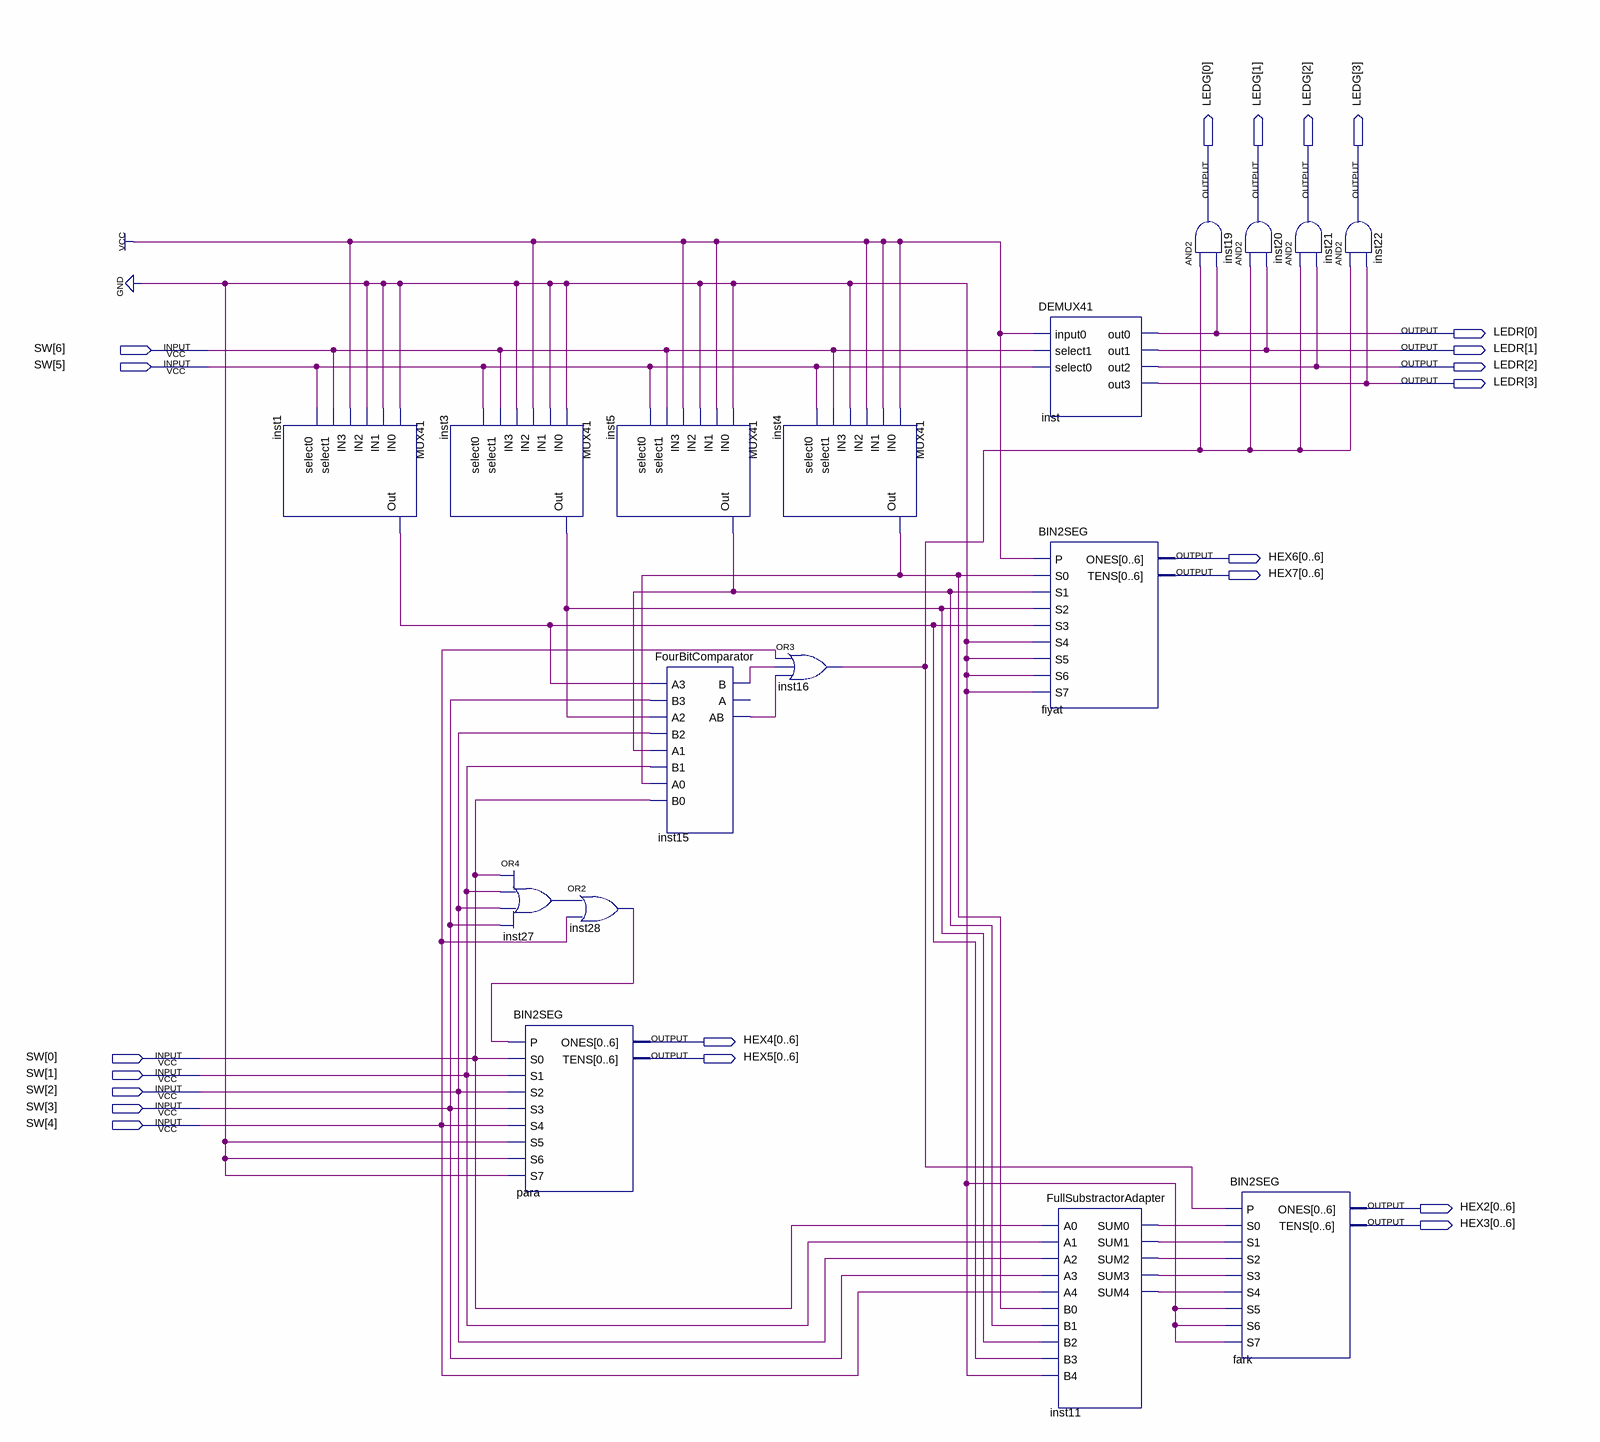
[diagram p0: schematic sheet]
// Quartus schematic Vending_Machine.bdf as structural Verilog: 17 symbols, 21 pins
module Vending_Machine (
  input  [6:0] SW,
  output [3:0] LEDG,
  output [3:0] LEDR,
  output [0:6] HEX6,
  output [0:6] HEX7,
  output [0:6] HEX4,
  output [0:6] HEX5,
  output [0:6] HEX2,
  output [0:6] HEX3
);

  wire inst1_out, inst3_out, inst4_out, inst5_out, inst11_sum0, inst11_sum1, inst11_sum2, inst11_sum3,
       inst11_sum4, inst15_ab, inst15_b, inst16_out, inst27_out, inst28_out;

  MUX41 inst1 (.IN0(1'b0), .IN1(1'b0), .IN2(1'b0), .IN3(1'b1), .select1(SW[6]), .select0(SW[5]), .Out(inst1_out));
  MUX41 inst3 (.IN0(1'b0), .IN1(1'b0), .IN2(1'b1), .IN3(1'b0), .select1(SW[6]), .select0(SW[5]), .Out(inst3_out));
  or inst27 (inst27_out, SW[0], SW[1], SW[2], SW[3]);
  BIN2SEG para (
    .P(inst28_out), .S0(SW[0]), .S1(SW[1]), .S2(SW[2]), .S3(SW[3]), .S4(SW[4]), .S5(1'b0), .S6(1'b0),
    .S7(1'b0), .ONES(HEX4), .TENS(HEX5));
  MUX41 inst5 (.IN0(1'b0), .IN1(1'b1), .IN2(1'b0), .IN3(1'b1), .select1(SW[6]), .select0(SW[5]), .Out(inst5_out));
  or inst28 (inst28_out, inst27_out, SW[4]);
  FourBitComparator inst15 (
    .A3(inst1_out), .B3(SW[3]), .A2(inst3_out), .B2(SW[2]), .A1(inst5_out), .B1(SW[1]), .A0(inst4_out),
    .B0(SW[0]), .B(inst15_b), .AB(inst15_ab));  // open: A
  MUX41 inst4 (.IN0(1'b1), .IN1(1'b1), .IN2(1'b1), .IN3(1'b0), .select1(SW[6]), .select0(SW[5]), .Out(inst4_out));
  or inst16 (inst16_out, SW[4], inst15_b, inst15_ab);
  DEMUX41 inst (
    .input0(1'b1), .select1(SW[6]), .select0(SW[5]), .out0(LEDR[0]), .out1(LEDR[1]), .out2(LEDR[2]),
    .out3(LEDR[3]));
  BIN2SEG fiyat (
    .P(1'b1), .S0(inst4_out), .S1(inst5_out), .S2(inst3_out), .S3(inst1_out), .S4(1'b0), .S5(1'b0),
    .S6(1'b0), .S7(1'b0), .ONES(HEX6), .TENS(HEX7));
  FullSubstractorAdapter inst11 (
    .A0(SW[0]), .A1(SW[1]), .A2(SW[2]), .A3(SW[3]), .A4(SW[4]), .B0(inst4_out), .B1(inst5_out),
    .B2(inst3_out), .B3(inst1_out), .B4(1'b0), .SUM0(inst11_sum0), .SUM1(inst11_sum1), .SUM2(inst11_sum2),
    .SUM3(inst11_sum3), .SUM4(inst11_sum4));
  and inst19 (LEDG[0], inst16_out, LEDR[0]);
  and inst20 (LEDG[1], inst16_out, LEDR[1]);
  BIN2SEG fark (
    .P(inst16_out), .S0(inst11_sum0), .S1(inst11_sum1), .S2(inst11_sum2), .S3(inst11_sum3), .S4(inst11_sum4),
    .S5(1'b0), .S6(1'b0), .S7(1'b0), .ONES(HEX2), .TENS(HEX3));
  and inst21 (LEDG[2], inst16_out, LEDR[2]);
  and inst22 (LEDG[3], inst16_out, LEDR[3]);
endmodule
